# EAGLE schematic początkowy_schemat (EAGLE 9.6.2)
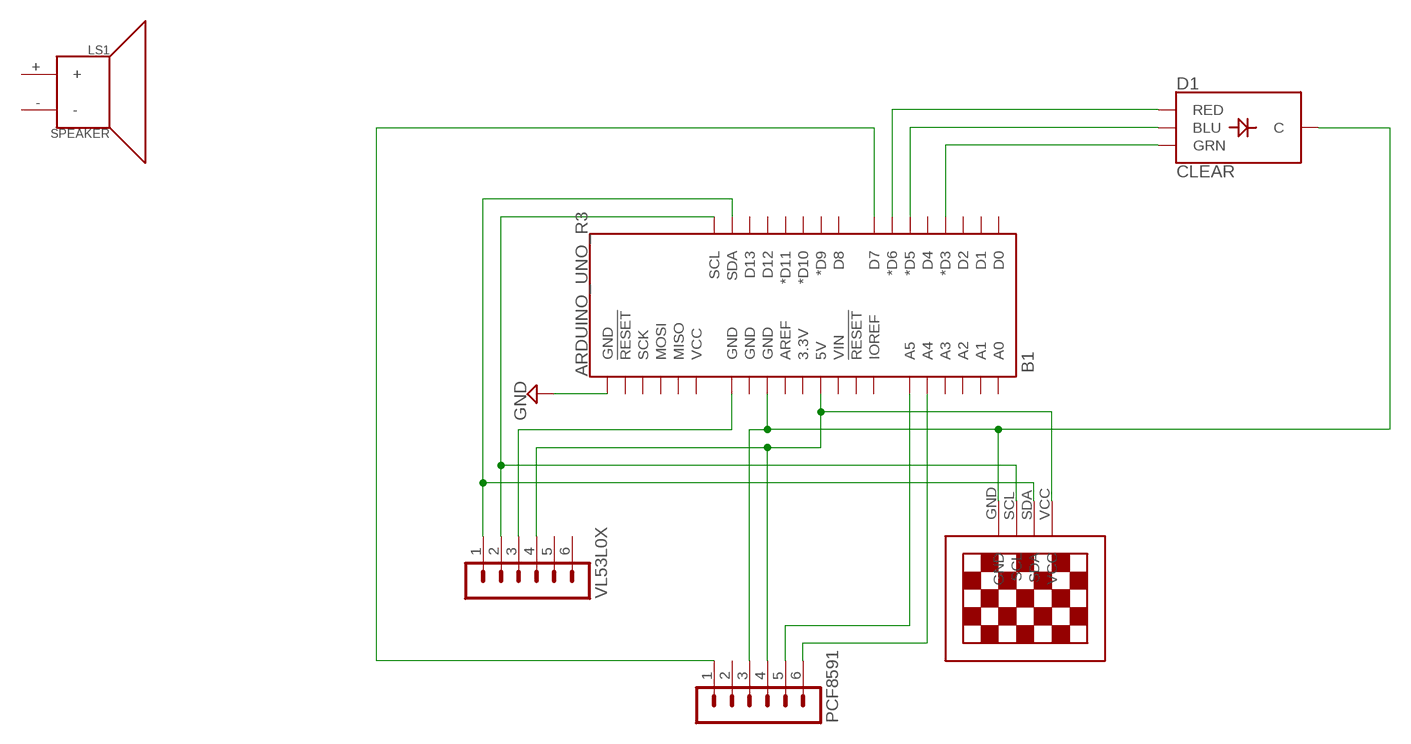
[diagram p0: schematic, sheet 1]

## Parts
B1  ARDUINO_UNO_R3  [ARDUINO_R3]
D1  CLEAR  LED-RGB-CCCLEAR  [LED-RGB-THRU]
LS1  SPEAKER  [PCB_MOUNT_SPEAKER]
PCF8591  MA06-1  [MA06-1]
U$1  13"OLED13"OLED  [1.3"OLED]
VL53L0X  MA06-1  [MA06-1]

## Nets
GND: B1.GND@1(GND)
N$1: B1.GND@2(GND) VL53L0X.3
N$2: B1.A4 PCF8591.6
N$3: B1.D3(*D3) D1.3(GRN)
N$4: B1.D5(*D5) D1.4(BLU)
N$5: B1.D6(*D6) D1.1(RED)
N$6: B1.5V PCF8591.4 U$1.VCC VL53L0X.4
N$7: B1.SCL U$1.SCL VL53L0X.2
N$8: B1.SDA U$1.SDA VL53L0X.1
N$9: B1.A5 PCF8591.5
N$10: B1.GND@4(GND) D1.2(C) PCF8591.3 U$1.GND
N$12: B1.D7 PCF8591.1
Unconnected: B1.3.3V B1.A0 B1.A1 B1.A2 B1.A3 B1.AREF B1.D0 B1.D1 B1.D2 B1.D4 B1.D8 B1.D9(*D9) B1.D10(*D10) B1.D11(*D11) B1.D12 B1.D13 B1.GND@3(GND) B1.IOREF B1.MISO B1.MOSI B1.RESET@1(!RESET!) B1.RESET@2(!RESET!) B1.SCK B1.VCC B1.VIN LS1.+ LS1.- PCF8591.2 VL53L0X.5 VL53L0X.6

## Library data of the parts
B1 = SparkFun-Boards:ARDUINO_UNO_R3: Arduino R3 Footprint with SPI header Arduino Uno R3 Compatible Footprint. Matches PCB size of the original board. SparkFun Products: SAMD21 Dev Breakout <https://www.sparkfun.com/products/13672> RedBoard <https://www.sparkfun.com/products/12757> R3 Stackable Headers <https://www.sparkfun.com/products/11417>
D1 = SparkFun-LED:LED-RGB-CC: LED-RGB Common Cathode Packages: LED RGB-THRU LED_PIRANHA_5MM SparkFun Products: RGB Diffused Common Cathode- Diffuse <[https://www.sparkfun.com/products/9264]> RGB Diffused Common Cathode - Clear <[https://www.sparkfun.com/products/105]> LED-RGB 5mm Square (Piranha) <[https://www.sparkfun.com/products/11679]>; PROD_ID: DIO-08418
LS1 = SparkFun-Electromechanical:SPEAKER: Speaker Generic 2-terminal loudspeakers SparkFun Products Speaker - PCB Mount <https://www.sparkfun.com/products/11089> (COM-11089); PROD_ID: COMP-11789; SF_SKU: COM-11089
PCF8591 VL53L0X = con-lstb:MA06-1: PIN HEADER; OC_FARNELL: unknown; OC_NEWARK: unknown
U$1 = 13oled:13"OLED